# Altium schematic sheet LM386.SchDoc
size A4
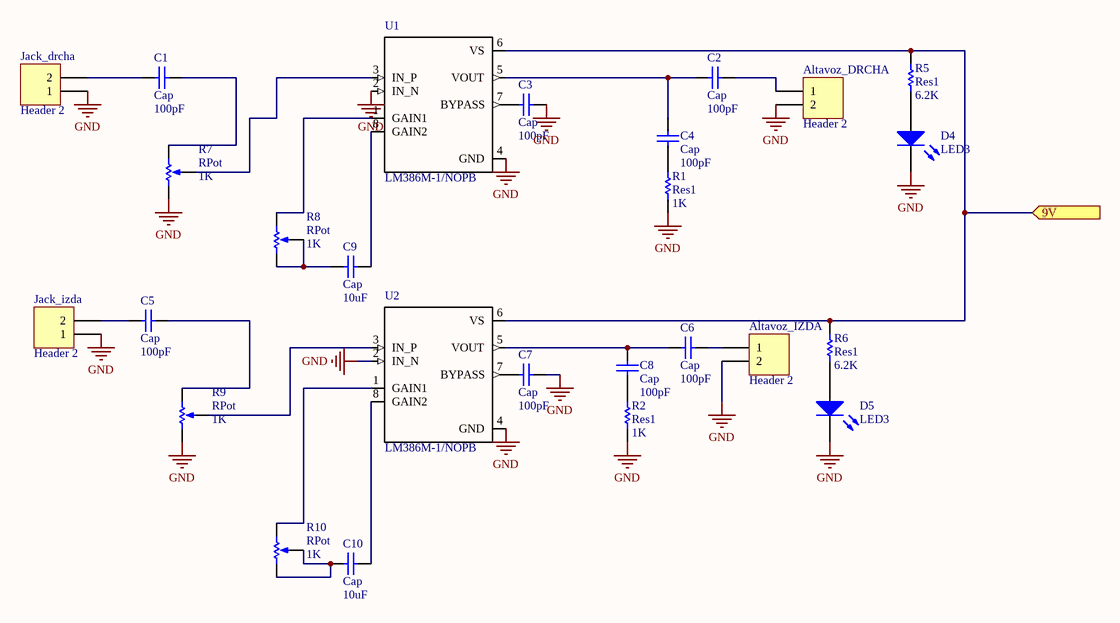
[diagram p0: LM386.SchDoc]

## Parts
Altavoz_DRCHA  Header 2  [HDR1X2]
Altavoz_IZDA  Header 2  [HDR1X2]
C1  Cap  value 100pF  [RAD-0.3]
C2  Cap  value 100pF  [RAD-0.3]
C3  Cap  value 100pF  [RAD-0.3]
C4  Cap  value 100pF  [RAD-0.3]
C5  Cap  value 100pF  [RAD-0.3]
C6  Cap  value 100pF  [RAD-0.3]
C7  Cap  value 100pF  [RAD-0.3]
C8  Cap  value 100pF  [RAD-0.3]
C9  Cap  value 10uF  [RAD-0.3]
C10  Cap  value 10uF  [RAD-0.3]
D4  LED3  [3.5X2.8X1.9]
D5  LED3  [3.5X2.8X1.9]
Jack_drcha  Header 2  [HDR1X2]
Jack_izda  Header 2  [HDR1X2]
R1  Res1  value 1K  [AXIAL-0.3]
R2  Res1  value 1K  [AXIAL-0.3]
R5  Res1  value 6.2K  [AXIAL-0.3]
R6  Res1  value 6.2K  [AXIAL-0.3]
R7  RPot  value 1K  [SOIC127P600X175-8N]
R8  RPot  value 1K  [VR5]
R9  RPot  value 1K  [VR5]
R10  RPot  value 1K  [VR5]
U1  LM386M-1/NOPB  [SOIC127P600X175-8N]
U2  LM386M-1/NOPB  [SOIC127P600X175-8N]

## Ports
9V (in)

## Nets
GND: Altavoz_DRCHA.2 Altavoz_IZDA.2 C3.1 C7.2 D4.2(K) D5.2(K) Jack_drcha.1 Jack_izda.1 R1.1 R2.1 R7.1(TOP) R9.1(TOP) U1.2(IN_N) U1.4(GND) U2.2(IN_N) U2.4(GND)
9V: R5.1 R6.1 U1.6(VS) U2.6(VS) ; port 9V
NetAltavoz_DRCHA_1: Altavoz_DRCHA.1 C2.2
NetAltavoz_IZDA_1: Altavoz_IZDA.1 C6.2
NetC1_1: C1.1 R7.2(BOT)
NetC1_2: C1.2 Jack_drcha.2
NetC2_1: C2.1 C4.2 U1.5(VOUT)
NetC3_2: C3.2 U1.7(BYPASS)
NetC4_1: C4.1 R1.2
NetC5_1: C5.1 R9.2(BOT)
NetC5_2: C5.2 Jack_izda.2
NetC6_1: C6.1 C8.2 U2.5(VOUT)
NetC7_1: C7.1 U2.7(BYPASS)
NetC8_1: C8.1 R2.2
NetC9_1: C9.1 U1.8(GAIN2)
NetC9_2: C9.2 R8.1(TOP) R8.3(TAP)
NetC10_1: C10.1 U2.8(GAIN2)
NetC10_2: C10.2 R10.1(TOP) R10.3(TAP)
NetD4_1: D4.1(A) R5.2
NetD5_1: D5.1(A) R6.2
NetR7_3: R7.3(TAP) U1.3(IN_P)
NetR8_2: R8.2(BOT) U1.1(GAIN1)
NetR9_3: R9.3(TAP) U2.3(IN_P)
NetR10_2: R10.2(BOT) U2.1(GAIN1)

## Library data of the parts
Altavoz_DRCHA Altavoz_IZDA Jack_drcha Jack_izda = Header 2: Header, 2-Pin; LatestRevisionDate: 17-Jul-2002; LatestRevisionNote: Re-released for DXP Platform.; Publisher: Altium Limited
C1-C10 = Cap: Capacitor; Published: 8-Jun-2000; LatestRevisionDate: 17-Jul-2002; LatestRevisionNote: Re-released for DXP Platform.; PackageReference: RAD-0.3; Publisher: Altium Limited; PackageDescription: Radial Cap, Thru-Hole; 2 Leads; 0.3 in Pin Spacing
D4 D5 = LED3: Typical BLUE SiC LED; Published: 8-Jun-2000; LatestRevisionDate: 17-Dec-2003; LatestRevisionNote: PCB Footprint replaced.; DatasheetVersion: 16-Apr-2002; PackageVersion: 16-Apr-2002; PackageReference: 3.5X2.8X1.9; Publisher: Altium Limited; PackageDescription: SM LED; 2 C-Bend Leads; Body 3.5 x 2.8 x 1.9 mm, inc leads (LxWxH typ)
R1 R2 R5 R6 = Res1: Resistor; Published: 8-Jun-2000; LatestRevisionDate: 17-Jul-2002; LatestRevisionNote: Re-released for DXP Platform.; PackageReference: AXIAL-0.3; Publisher: Altium Limited; PackageDescription: Axial Device, Thru-Hole; 2 Leads; 0.3 in Pin Spacing
R7-R10 = RPot: Potentiometer; Sim Note: Enter the Resistance value and the set point into parameter fields.; Set Position: 0.5; Published: 8-Jun-2000; LatestRevisionDate: 17-Jul-2002; LatestRevisionNote: Re-released for DXP Platform.; PackageReference: VR5; Publisher: Altium Limited; PackageDescription: Variable Resistor, Thru-Hole; 3 Leads
U1 U2 = LM386M-1/NOPB: Wide Input Voltage Low Power Audio Amplifier with Internal Gain 8-SOIC 0 to 70; MF: Texas Instruments; Price: 0.76 USD; MP: LM386M-1; Availability: Good; SnapEDA_Link: https://www.snapeda.com/parts/LM386M-1/Texas%20Instruments/view-part/?ref=snap; Package: SOIC-8 Texas Instruments; Value: *